# EAGLE design MotorSliderNoPower (EAGLE 9.6.2)
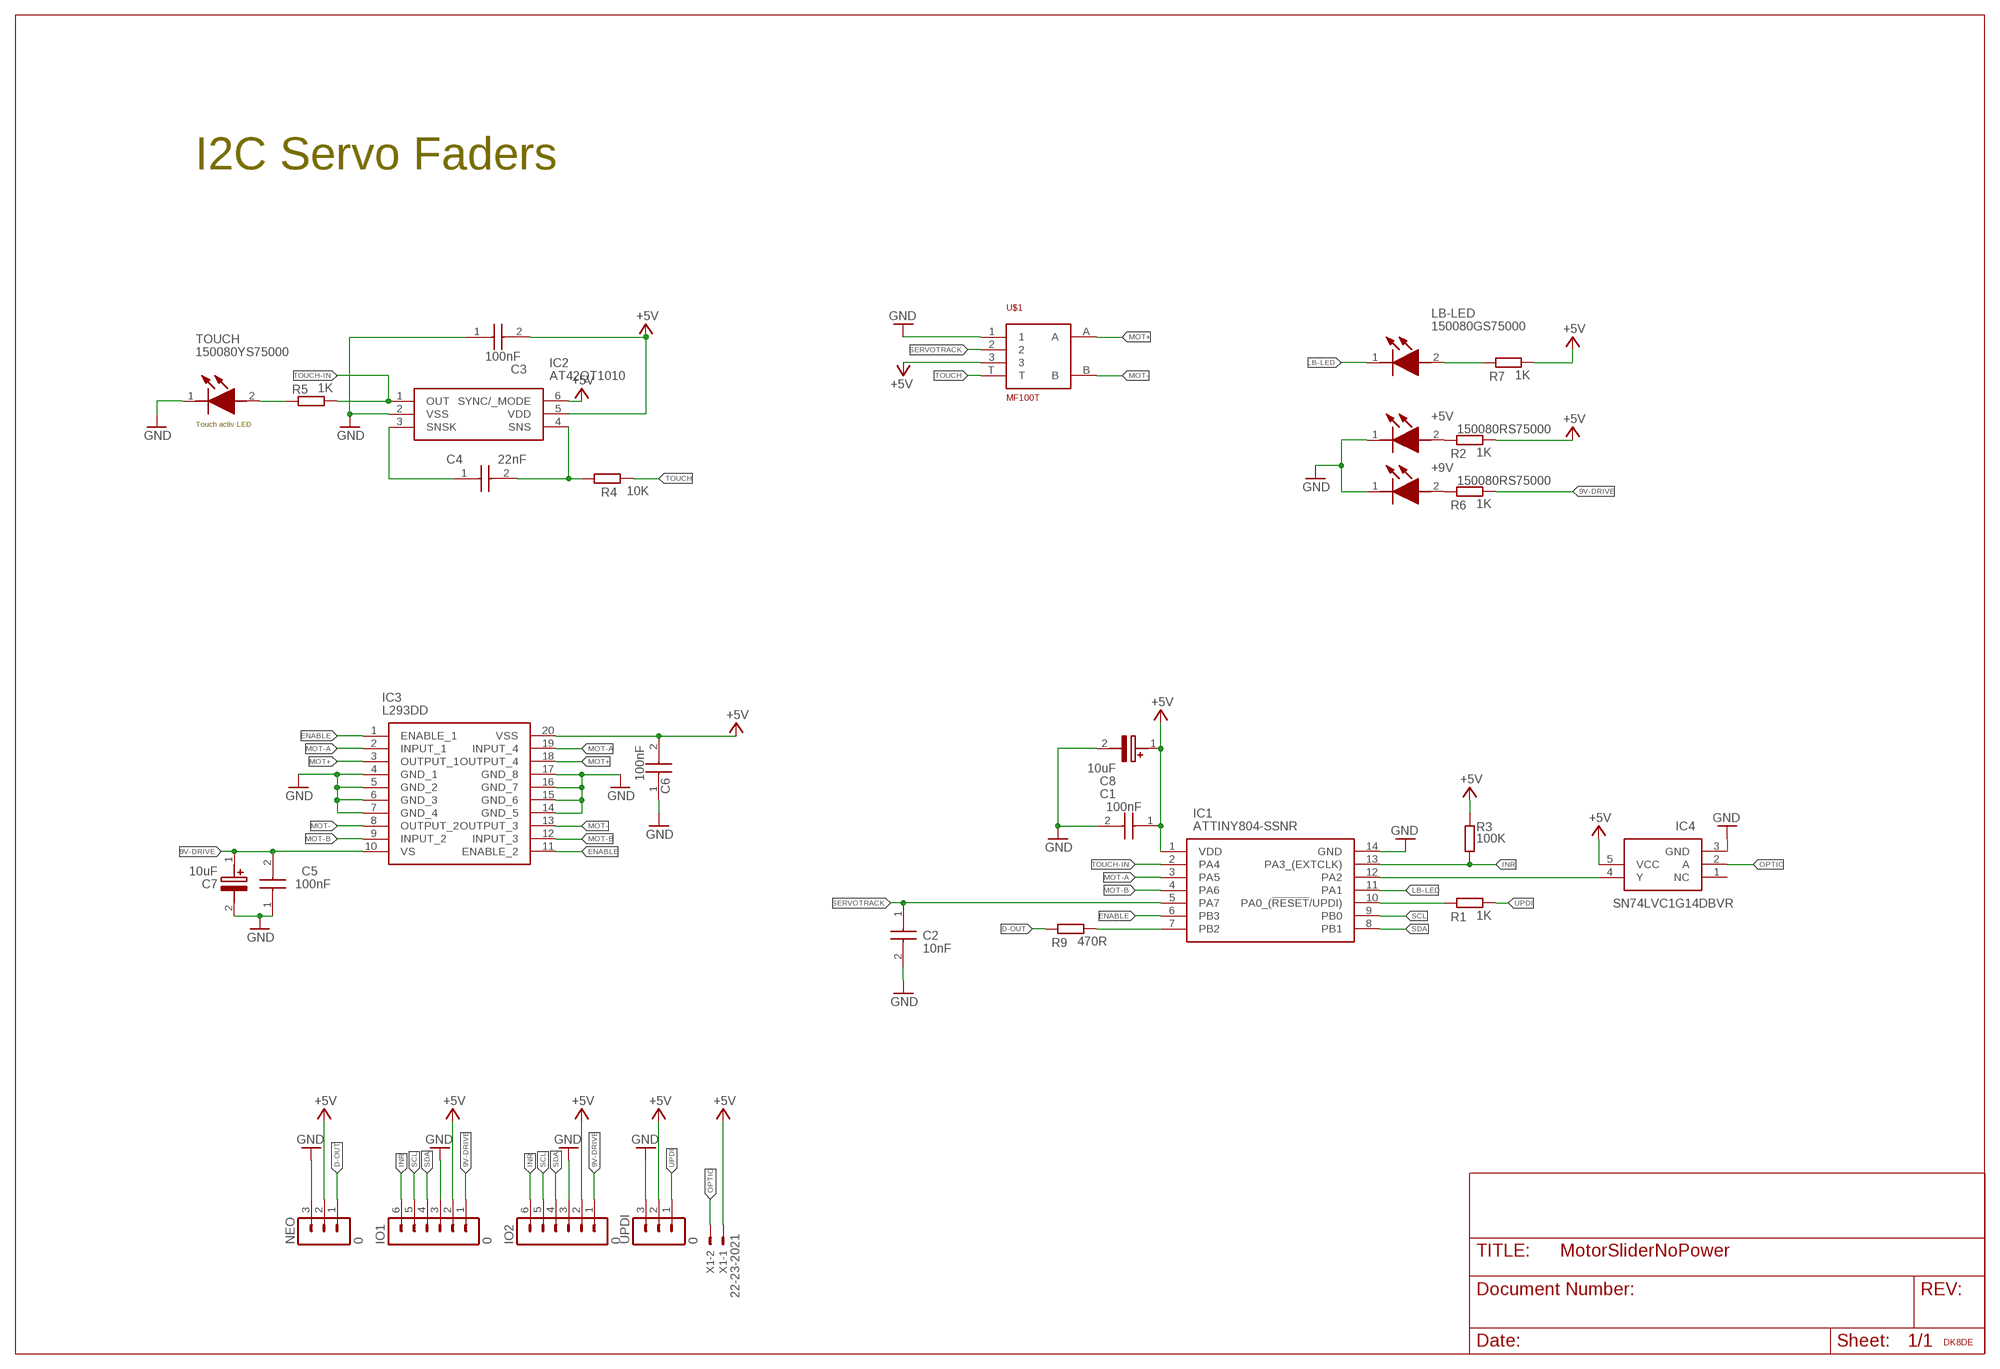
[diagram p0: schematic, sheet 1]

## Parts
+5V  150080RS75000  [LEDC2012X80N]
+9V  150080RS75000  [LEDC2012X80N]
C1  100nF  C0805C104K1RACTU  [C0805]
C2  10nF  C0805Y103K4RACTU  [C0805]
C3  100nF  C0805C104K1RACTU  [C0805]
C4  22nF  C0805C333K4RACTU  [C0805]
C5  100nF  C0805C104K1RACTU  [C0805]
C6  100nF  C0805C104K1RACTU  [C0805]
C7  10uF  EEE-HB1C100R  [EEE1AA220WR]
C8  10uF  EEE-HB1C100R  [EEE1AA220WR]
IC1  ATTINY804-SSNR  [SOIC127P600X175-14N]
IC2  AT42QT1010  AT42QT1010-TSHR  [SOT95P280X145-6N]
IC3  L293DD  [SOIC127P1032X265-20N]
IC4  SN74LVC1G14DBVR  [SOT95P280X145-5N]
IO1  0  MA06-1  [MA06-1]
IO2  0  MA06-1  [MA06-1]
LB-LED  150080GS75000  [LEDM2012X80N]
NEO  0  MA03-1  [MA03-1]
R1  1K  R-EU_R0805  [R0805]
R2  1K  R-EU_R0805  [R0805]
R3  100K  R-EU_R0805  [R0805]
R4  10K  R-EU_R0805  [R0805]
R5  1K  R-EU_R0805  [R0805]
R6  1K  R-EU_R0805  [R0805]
R7  1K  R-EU_R0805  [R0805]
R9  470R  R-EU_R0805  [R0805]
TOUCH  150080YS75000  [LEDC2012X80N]
U$1  MF100T  SM10001NKA0X-HA1  [SM10001NKA0X-HA1]
U$2  DK8DESS  [DK8DE_KLEIN]
UPDI  0  MA03-1  [MA03-1]
X1  22-23-2021  [22-23-2021]

## Nets
9V-DRIVE: C5.2 C7.1(+) IC3.10(VS) IO1.1 IO2.1 R6.2
+5V: C1.1 C3.2 C6.2 C8.1(+) IC1.1(VDD) IC2.5(VDD) IC2.6(SYNC/_MODE) IC3.20(VSS) IC4.5(VCC) IO1.2 IO2.2 NEO.2 R2.2 R3.1 R7.2 U$1.3 UPDI.2 X1.1
D-OUT: NEO.1 R9.1
ENABLE: IC1.6(PB3) IC3.1(ENABLE_1) IC3.11(ENABLE_2)
GND: +5V.1(K) +9V.1(K) C1.2 C2.2 C3.1 C5.1 C6.1 C7.2(-) C8.2(-) IC1.14(GND) IC2.2(VSS) IC3.4(GND_1) IC3.5(GND_2) IC3.6(GND_3) IC3.7(GND_4) IC3.14(GND_5) IC3.15(GND_6) IC3.16(GND_7) IC3.17(GND_8) IC4.3(GND) IO1.3 IO2.3 NEO.3 TOUCH.1(K) U$1.1 UPDI.3
INR: IC1.13(PA3_(EXTCLK)) IO1.6 IO2.6 R3.2
LB-LED: IC1.11(PA1) LB-LED.1(K)
MOT+: IC3.3(OUTPUT_1) IC3.18(OUTPUT_4) U$1.A
MOT-: IC3.8(OUTPUT_2) IC3.13(OUTPUT_3) U$1.B
MOT-A: IC1.3(PA5) IC3.2(INPUT_1) IC3.19(INPUT_4)
MOT-B: IC1.4(PA6) IC3.9(INPUT_2) IC3.12(INPUT_3)
N$1: IC1.10(PA0_(!RESET!/UPDI)) R1.1
N$2: +5V.2(A) R2.1
N$3: +9V.2(A) R6.1
N$4: IC1.12(PA2) IC4.4(Y)
N$5: LB-LED.2(A) R7.1
N$6: IC1.7(PB2) R9.2
N$7: C4.1 IC2.3(SNSK)
N$8: C4.2 IC2.4(SNS) R4.1
N$9: R5.1 TOUCH.2(A)
OPTIO: IC4.2(A) X1.2
SCL: IC1.9(PB0) IO1.5 IO2.5
SDA: IC1.8(PB1) IO1.4 IO2.4
SERVOTRACK: C2.1 IC1.5(PA7) U$1.2
TOUCH: R4.2 U$1.T
TOUCH-IN: IC1.2(PA4) IC2.1(OUT) R5.2
UPDI: R1.2 UPDI.1
Unconnected: IC4.1(NC)

## Notes on the sheet
- I2C Servo Faders
- Touch activ LED

## Library data of the parts
+5V +9V = SamacSys_Parts:150080RS75000: LED,Wurth Elektronik,150080RS75000 Wurth Elektronik 150080RS75000, WL-SMCW Series Red LED, 625 nm 2012 (0805) Clear, Rectangle Lens SMD package Source: Datasheet <https://componentsearchengine.com/Datasheets/2/150080RS75000.pdf>; DESCRIPTION: LED,Wurth Elektronik,150080RS75000 Wurth Elektronik 150080RS75000, WL-SMCW Series Red LED, 625 nm 2012 (0805) Clear, Rectangle Lens SMD package; HEIGHT: 0.8mm; MANUFACTURER_NAME: Wurth Elektronik; MANUFACTURER_PART_NUMBER: 150080RS75000; MOUSER_PART_NUMBER: 710-150080RS75000; MOUSER_PRICE-STOCK: https://www.mouser.co.uk/ProductDetail/Wurth-Elektronik/150080RS75000?qs=LlUlMxKIyB2jdCo7bnfgew%3D%3D
C1 C3 C5 C6 = SamacSys_Parts:C0805C104K1RACTU: SMD Comm X7R, Ceramic, 0.1 uF, 10%, 100 VDC, 250 VDC, 125C, -55C, X7R, SMD, MLCC, Temperature Stable, Class II, 2.5 % , 10 GOhms, 16 mg, 0805, 2mm, 1.25mm, 1mm, 0.75mm, 0.5mm, 2500, 78 Weeks, 80 Source: Datasheet <https://content.kemet.com/datasheets/KEM_C1002_X7R_SMD.pdf>; DESCRIPTION: SMD Comm X7R, Ceramic, 0.1 uF, 10%, 100 VDC, 250 VDC, 125C, -55C, X7R, SMD, MLCC, Temperature Stable, Class II, 2.5 % , 10 GOhms, 16 mg, 0805, 2mm, 1.25mm, 1mm, 0.75mm, 0.5mm, 2500, 78 Weeks, 80; HEIGHT: 1.1mm; MANUFACTURER_NAME: KEMET; MANUFACTURER_PART_NUMBER: C0805C104K1RACTU; MOUSER_PART_NUMBER: 80-C0805C104K1R; MOUSER_PRICE-STOCK: https://www.mouser.co.uk/ProductDetail/KEMET/C0805C104K1RACTU?qs=%252BnQd%252BVdkwTpk7hSy9esUqA%3D%3D
C2 = SamacSys_Parts:C0805Y103K4RACTU: SMD Comm X7R FF, Ceramic, 0.01 uF, 10%, 16 VDC, 40 VDC, 125C, -55C, X7R, SMD, MLCC, FF-CAP, Floating Electrode, 3.5 % , 100 GOhms, 13 mg, 0805, 2mm, 1.25mm, 0.78mm, 0.75mm, 0.5mm, 4000, 78 Weeks, 80 Source: Datasheet <https://content.kemet.com/datasheets/KEM_C1015_X7R_FF-CAP_SMD.pdf>; DESCRIPTION: SMD Comm X7R FF, Ceramic, 0.01 uF, 10%, 16 VDC, 40 VDC, 125C, -55C, X7R, SMD, MLCC, FF-CAP, Floating Electrode, 3.5 % , 100 GOhms, 13 mg, 0805, 2mm, 1.25mm, 0.78mm, 0.75mm, 0.5mm, 4000, 78 Weeks, 80; HEIGHT: 1.1mm; MANUFACTURER_NAME: KEMET; MANUFACTURER_PART_NUMBER: C0805Y103K4RACTU; MOUSER_PART_NUMBER: 80-C0805Y103K4R; MOUSER_PRICE-STOCK: https://www.mouser.co.uk/ProductDetail/KEMET/C0805Y103K4RACTU?qs=sbamQQFaV8yazvNwKcnfeQ%3D%3D
C4 = SamacSys_Parts:C0805C333K4RACTU: SMD Comm X7R, Ceramic, 0.033 uF, 10%, 16 VDC, 40 VDC, 125C, -55C, X7R, SMD, MLCC, Temperature Stable, Class II, 3.5 % , 30.303 GOhms, 11 mg, 0805, 2mm, 1.25mm, 0.78mm, 0.75mm, 0.5mm, 4000, 78 Weeks, 80 Source: Datasheet <https://content.kemet.com/datasheets/KEM_C1002_X7R_SMD.pdf>; DESCRIPTION: SMD Comm X7R, Ceramic, 0.033 uF, 10%, 16 VDC, 40 VDC, 125C, -55C, X7R, SMD, MLCC, Temperature Stable, Class II, 3.5 % , 30.303 GOhms, 11 mg, 0805, 2mm, 1.25mm, 0.78mm, 0.75mm, 0.5mm, 4000, 78 Weeks, 80; HEIGHT: 1.1mm; MANUFACTURER_NAME: KEMET; MANUFACTURER_PART_NUMBER: C0805C333K4RACTU; MOUSER_PART_NUMBER: 80-C0805C333K4R; MOUSER_PRICE-STOCK: https://www.mouser.co.uk/ProductDetail/KEMET/C0805C333K4RACTU?qs=2C4V03aRTluNFfWAly6Z3Q%3D%3D
C7 C8 = SamacSys_Parts:EEE-HB1C100R: SMD elec cap 10uF 16V Panasonic Aluminium Electrolytic Capacitor 10uF 16 V dc 4mm Surface Mount series HB SMD lifetime 2000h Source: Datasheet <http://industrial.panasonic.com/cdbs/www-data/pdf/RDE0000/ABA0000C1157.pdf>; DESCRIPTION: SMD elec cap 10uF 16V Panasonic Aluminium Electrolytic Capacitor 10uF 16 V dc 4mm Surface Mount series HB SMD lifetime 2000h; HEIGHT: 5.5mm; MANUFACTURER_NAME: Panasonic; MANUFACTURER_PART_NUMBER: EEE-HB1C100R; MOUSER_PART_NUMBER: 667-EEE-HB1C100R; MOUSER_PRICE-STOCK: https://www.mouser.co.uk/ProductDetail/Panasonic/EEE-HB1C100R?qs=Ywefl8B65e6oXncmMfFctg%3D%3D
IC1 = SamacSys_Parts:ATTINY804-SSNR: 8-bit Microcontrollers - MCU 20MHz, 8KB, SOIC14, Ind 105C, Green, T&R Source: Datasheet <https://componentsearchengine.com/Datasheets/1/ATTINY804-SSNR.pdf>; DESCRIPTION: 8-bit Microcontrollers - MCU 20MHz, 8KB, SOIC14, Ind 105C, Green, T&R; HEIGHT: 1.75mm; MANUFACTURER_NAME: Microchip; MANUFACTURER_PART_NUMBER: ATTINY804-SSNR; MOUSER_PART_NUMBER: 556-ATTINY804-SSNR; MOUSER_PRICE-STOCK: https://www.mouser.co.uk/ProductDetail/Microchip-Technology/ATTINY804-SSNR?qs=T3oQrply3y%252BBKoVZpNVlTw%3D%3D
IC2 = SamacSys_Parts:AT42QT1010-TSHR: AT42QT1010-TSHR, Spread-Spectrum Charge-Transfer Touch Screen Controller, 14 bit, 6-Pin SOT-23 Source: Datasheet <http://www.atmel.com/images/atmel-9541-at42-qtouch-bsw-at42qt1010_datasheet.pdf>; DESCRIPTION: AT42QT1010-TSHR, Spread-Spectrum Charge-Transfer Touch Screen Controller, 14 bit, 6-Pin SOT-23; HEIGHT: 1.45mm; MANUFACTURER_NAME: Microchip; MANUFACTURER_PART_NUMBER: AT42QT1010-TSHR; MOUSER_PART_NUMBER: 556-AT42QT1010-TSHR; MOUSER_PRICE-STOCK: https://www.mouser.co.uk/ProductDetail/Microchip-Technology/AT42QT1010-TSHR?qs=xbJoyvfFV%2F%252BFK88JVR2efg%3D%3D
IC3 = SamacSys_Parts:L293DD: L293DD, Motor Driver, 4.5 36 V, 20-Pin SOIC Source: Datasheet <https://www.st.com/resource/en/datasheet/l293d.pdf>; DESCRIPTION: L293DD, Motor Driver, 4.5 36 V, 20-Pin SOIC; HEIGHT: 2.65mm; MANUFACTURER_NAME: STMicroelectronics; MANUFACTURER_PART_NUMBER: L293DD; MOUSER_PART_NUMBER: 511-L293DD; MOUSER_PRICE-STOCK: https://www.mouser.co.uk/ProductDetail/STMicroelectronics/L293DD?qs=m4gxtLzGBzoksItTiSkcgg%3D%3D
IC4 = SamacSys_Parts:SN74LVC1G14DBVR: TEXAS INSTRUMENTS - SN74LVC1G14DBVR - IC, SCHMITT TRIGGER INVERTER, SMD Source: Datasheet <https://datasheet.datasheetarchive.com/originals/distributors/Datasheets-DGA13/1136296.pdf>; DESCRIPTION: TEXAS INSTRUMENTS - SN74LVC1G14DBVR - IC, SCHMITT TRIGGER INVERTER, SMD; HEIGHT: 1.45mm; MANUFACTURER_NAME: Texas Instruments; MANUFACTURER_PART_NUMBER: SN74LVC1G14DBVR; MOUSER_PART_NUMBER: 595-SN74LVC1G14DBVR; MOUSER_PRICE-STOCK: https://www.mouser.co.uk/ProductDetail/Texas-Instruments/SN74LVC1G14DBVR?qs=dT9u2OTAaVWRIgCrQFnxuQ%3D%3D
IO1 IO2 = con-lstb_IBM:MA06-1: PIN HEADER; OC_FARNELL: unknown; OC_NEWARK: unknown
LB-LED = SamacSys_Parts:150080GS75000: 150080GS75000, Wurth Elektronik WL-SMCW 520 nm Green LED, 2012 (0805) Clear SMD package Source: Datasheet <https://katalog.we-online.com/led/datasheet/150080GS75000.pdf>; DESCRIPTION: 150080GS75000, Wurth Elektronik WL-SMCW 520 nm Green LED, 2012 (0805) Clear SMD package; HEIGHT: 0.8mm; MANUFACTURER_NAME: Wurth Elektronik; MANUFACTURER_PART_NUMBER: 150080GS75000; MOUSER_PART_NUMBER: 710-150080GS75000; MOUSER_PRICE-STOCK: https://www.mouser.co.uk/ProductDetail/Wurth-Elektronik/150080GS75000?qs=2kOmHSv6VfQRoTEZVk1mGA%3D%3D
NEO UPDI = con-lstb:MA03-1: PIN HEADER; OC_FARNELL: unknown; OC_NEWARK: unknown
R1-R7 R9 = rcl:R-EU_: RESISTOR, European symbol; SPICEPREFIX: R
TOUCH = SamacSys_Parts:150080YS75000: LED,Wurth Elektronik,150080YS75000 Source: Datasheet <https://katalog.we-online.de/led/datasheet/150080YS75000.pdf>; DESCRIPTION: LED,Wurth Elektronik,150080YS75000; HEIGHT: 0.8mm; MANUFACTURER_NAME: Wurth Elektronik; MANUFACTURER_PART_NUMBER: 150080YS75000; MOUSER_PART_NUMBER: 710-150080YS75000; MOUSER_PRICE-STOCK: https://www.mouser.co.uk/ProductDetail/Wurth-Elektronik/150080YS75000?qs=LlUlMxKIyB3k0fZGrDMI2w%3D%3D
U$1 = Slider:SM10001NKA0X-HA1: Behringer X-Touch Motor-Fader MF100T
U$2 = LOGOS:DK8DE
X1 = con-molex:22-23-2021: .100" (2.54mm) Center Header - 2 Pin; MF: MOLEX; MPN: 22-23-2021; OC_FARNELL: 1462926; OC_NEWARK: 25C3832

## Board
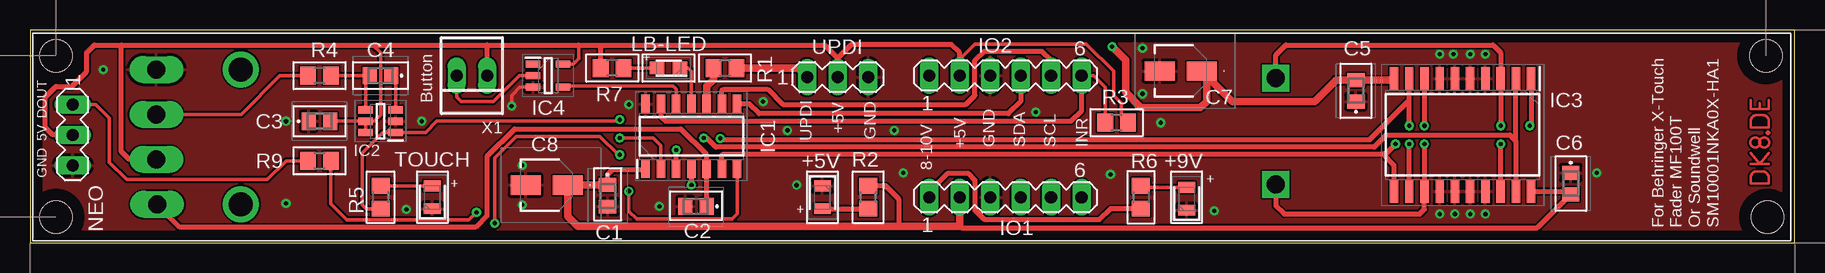
[diagram p1: board, top side]
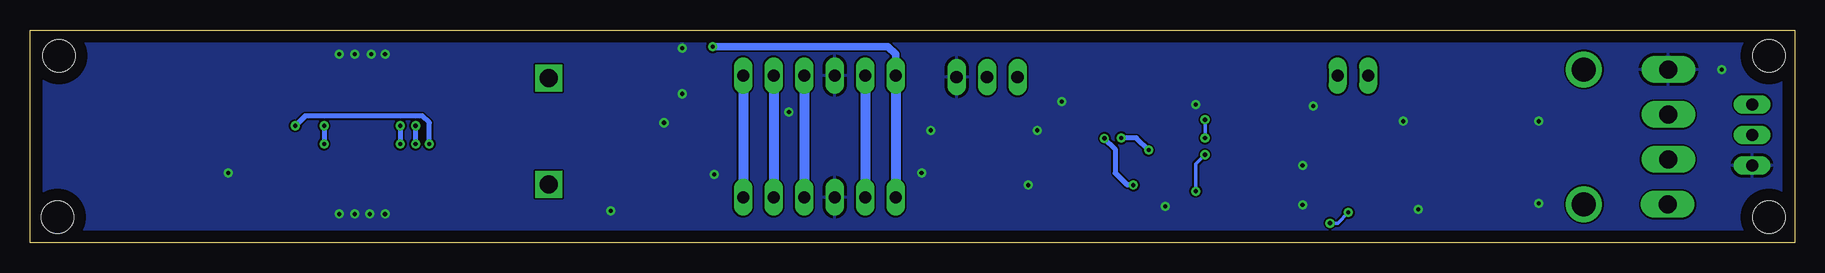
[diagram p2: board, bottom side, seen from below]

Size 147.07 x 17.78 mm. Coordinates in mm from the lower left corner, seen from the top.
Outline: 0,0 147.07,0 147.07,17.78 0,17.78 0,0
Copper layers (1*16): Top 0.035mm / dielectric 0.15mm / Bottom 0.035mm
Design rules "Aisler": minimum track width 6mil, minimum drill 0.35mm, track to track 6mil, track to pad 6mil, pad to pad 6mil, via to via 6mil, smd to smd 6mil, copper to edge 40mil, drill to drill 6mil, minimum pad ring 10mil, minimum via ring 8mil, stop-mask expansion 4mil, vias tented up to drill 0mil, thermal gap 10mil
Holes 2.69 mm at 144.65,15.62 144.78,2.16 2.16,15.62 2.16,2.16

### Footprints (pad centres in the part's own frame; a part is rotated, then mirrored left to right if it is on the bottom)
LEDC2012X80N = smd 0.9 x 1.4: 1 -0.95,0; 2 0.95,0
C0805 = smd 1.15 x 1.45: 1 -0.9,0; 2 0.9,0
EEE1AA220WR = smd 2.5 x 1.6: 1 -1.75,0; 2 1.75,0
SOIC127P600X175-14N = smd 1.525 x 0.7: 1 -2.712,3.81; 2 -2.712,2.54; 3 -2.712,1.27; 4 -2.712,0; 5 -2.712,-1.27; 6 -2.712,-2.54; 7 -2.712,-3.81; 8 2.712,-3.81; 9 2.712,-2.54; 10 2.712,-1.27; 11 2.712,0; 12 2.712,1.27; 13 2.712,2.54; 14 2.712,3.81
SOT95P280X145-6N = smd 1.2 x 0.6: 1 -1.25,0.95; 2 -1.25,0; 3 -1.25,-0.95; 4 1.25,-0.95; 5 1.25,0; 6 1.25,0.95
SOIC127P1032X265-20N = smd 1.925 x 0.7: 1 -4.712,5.715; 2 -4.712,4.445; 3 -4.712,3.175; 4 -4.712,1.905; 5 -4.712,0.635; 6 -4.712,-0.635; 7 -4.712,-1.905; 8 -4.712,-3.175; 9 -4.712,-4.445; 10 -4.712,-5.715; 11 4.712,-5.715; 12 4.712,-4.445; 13 4.712,-3.175; 14 4.712,-1.905; 15 4.712,-0.635; 16 4.712,0.635; 17 4.712,1.905; 18 4.712,3.175; 19 4.712,4.445; 20 4.712,5.715
SOT95P280X145-5N = smd 1.2 x 0.6: 1 -1.25,0.95; 2 -1.25,0; 3 -1.25,-0.95; 4 1.25,-0.95; 5 1.25,0.95
MA06-1 = drill 1.016 long: 1 -6.35,0; 2 -3.81,0; 3 -1.27,0; 4 1.27,0; 5 3.81,0; 6 6.35,0
LEDM2012X80N = smd 1.2 x 1.05: 1 -0.95,0; 2 0.95,0
MA03-1 = drill 1.016 long: 1 -2.54,0; 2 0,0; 3 2.54,0
R0805 = smd 1.3 x 1.5: 1 -0.95,0; 2 0.95,0
SM10001NKA0X-HA1 = drill 1.5 long: 1 0,0; 2 0.05,-11.25; 3 0,-7.5; T 0,-3.75 | drill 1.5 square: A 93.291,-0.703; B 93.291,-9.61 | drill 2: P$7 7.032,-11.251; P$8 7.032,0
22-23-2021 = drill 1 long: 1 -1.27,0; 2 1.27,0

### Placement (x,y rotation side)
+5V  66.04,3.81 270 top
+9V  96.39,3.68 90 top
C1  48.13,3.94 270 top
C2  55.5,3.05 180 top
C3  24.13,10.16 0 top
C4  29.21,13.97 180 top
C5  110.49,12.7 90 top
C6  128.4,4.95 270 top
C7  95.89,14.35 180 top
C8  43.05,4.83 180 top
IC1  55.12,8.89 90 top
IC2  29.21,10.16 180 top
IC3  119.38,9.02 270 top
IC4  43.18,13.97 0 top
IO1  81.28,3.81 0 top
IO2  81.28,13.97 0 top
LB-LED  53.21,14.61 180 top
NEO  3.56,9.02 270 top
R1  57.91,14.61 0 top
R2  69.85,3.81 90 top
R3  90.55,10.03 180 top
R4  24.13,13.97 180 top
R5  29.21,3.81 270 top
R6  92.58,3.81 270 top
R7  48.51,14.61 180 top
R9  24.13,6.86 0 top
TOUCH  33.53,3.81 90 top
U$1  10.54,14.48 0 top
U$2  144.15,7.75 90 top
UPDI  67.31,13.84 0 top
X1  36.83,13.97 180 top

### Tracks (layer width: path | path; a pad name or v marks a point on that pad's centre or on a via)
9V-DRIVE  (via drill 0.35)
  Top 0.406: R6.2 90.04,2.86 89.11,1.93 79.55,1.93 78.77,2.71 78.77,5.24 78.21,5.79 76.45,5.79 74.93,4.27 IO1.1
  Top 0.61: v90.17,16.39 91.31,15.24 91.31,12.57 92.58,11.3 97.54,11.3 98.04,11.81 98.04,13.94 C7.1 100.17,11.81 107.06,11.81 108.85,13.6 C5.2 113.54,13.6 IC3.10
  Bottom 0.61: IO2.1 74.93,15.75 75.57,16.39 v90.17,16.39
  Bottom 0.813: IO2.1 IO1.1
+5V
  Top 0.305: IC2.5 28.7,10.16 29.21,10.67 29.21,15.88 28.57,16.51 | C3.2 IC2.5 | IC2.5 IC2.6 | 47.75,16.51 45.72,16.51 45.72,15.37 45.27,14.92 IC4.5 | 38.1,16.51 28.57,16.51 | 47.75,16.51 66.22,16.51 | 47.56,16.32 47.75,16.51 | 28.57,16.51 7.62,16.51 | IO2.2 77.47,15.34 78.74,16.61 88.04,16.61 90.3,14.35 90.3,12.32 90.93,11.68 90.93,10.6 R3.1
  Top 0.406: IO2.2 77.47,15.88 76.78,16.56 68.45,16.56 67.31,15.42 | C1.1 48.13,5.73 48.51,6.11 51.24,6.11 IC1.1 | IC3.20 128.15,4.3 C6.2 125.61,1.27 77.6,1.27 77.47,1.4 | 72.39,1.4 72.39,3.68 71.31,4.76 R2.2 | U$1.3 8.26,6.98 7.62,7.62 7.62,16.51 | 7.62,16.51 38.1,16.51 | 38.1,16.51 45.72,16.51 66.22,16.51 67.31,15.42 | UPDI.2 67.31,15.42 | R7.2 47.56,16.32 | NEO.2 1.91,9.02 1.27,9.65 1.27,12.17 2.16,13.06 3.48,13.06 4.72,14.3 4.72,15.88 5.36,16.51 7.62,16.51 | X1.1 38.1,16.51
  Top 0.61: C1.1 44.81,4.84 C8.1 44.8,2.24 45.64,1.4 72.39,1.4 77.47,1.4 IO1.2
  Bottom 0.813: IO2.2 IO1.2
D-OUT
  Top 0.305: NEO.1 5.46,11.56 6.6,10.41 6.6,6.73 8.05,5.29 19.76,5.29 21.34,6.86 R9.1
ENABLE  (via drill 0.35)
  Top 0.406: IC1.6 57.66,7.32 57.76,7.42 112.72,7.42 | IC3.11 113.67,6.48 112.72,7.42 | IC3.1 125.09,9.91 v124.97,9.78 | v113.79,8.26 112.96,7.42 112.72,7.42
  Bottom 0.406: v113.79,8.26 113.79,10.03 114.36,10.6 124.14,10.6 v124.97,9.78
GND  (via drill 0.35)
  Top 0.305: IC4.3 40.83,13.02 40.13,12.32 v40.13,11.43
  other vias: 49.91,11.56 41.02,6.48 41.02,3.17 31.37,2.79 21.34,10.16 92.71,16.26 92.71,12.45 98.68,2.67 120.02,2.41 120.02,15.75 130.56,5.84 61.09,11.81 63.88,4.83 72.01,9.4 72.77,5.84 90.04,5.71 94.23,10.03 63.12,9.4 118.62,15.75 118.75,2.41 117.47,2.41 121.28,2.41 117.47,15.75 121.28,15.75 52.45,3.05 32.64,10.16 21.34,3.3 6.1,14.48 83.82,10.92
  pour Bottom: 0,17.78 147.07,17.78 147.07,0 0,0
  pour Top: 0,17.78 147.07,17.78 147.07,0 0,0
INR
  Top 0.305: IO2.6 88.65,13.97 89.6,13.02 R3.2
  Top 0.406: IC1.13 52.58,10.54 52.96,10.16 86.74,10.16 87.63,11.05 IO2.6
  Bottom 0.813: IO2.6 IO1.6
LB-LED
  Top 0.305: LB-LED.1 54.86,14.61 55.12,14.35 IC1.11
MOT+  (via drill 0.35)
  Top 0.406: v122.56,9.78 IC3.3 122.56,15.88 121.92,16.51 104.66,16.51 103.83,15.68 U$1.A | IC3.18 v122.56,8.26
  Bottom 0.406: v122.56,9.78 v122.56,8.26
MOT-  (via drill 0.35)
  Top 0.406: U$1.B 103.83,3.09 104.51,2.41 115.82,2.41 116.2,2.79 IC3.13 v116.2,8.26 | IC3.8 v116.2,9.78
  Bottom 0.406: v116.2,9.78 v116.2,8.26
MOT-A  (via drill 0.35)
  Top 0.406: IC1.3 v53.85,7.75 | v56.13,8.76 56.39,8.76 57.15,8 112.01,8 113.03,9.02 123.32,9.02 123.83,8.51 | 123.83,8.51 IC3.19 | 123.83,8.51 IC3.2
  Bottom 0.406: v56.13,8.76 54.86,8.76 v53.85,7.75
MOT-B  (via drill 0.35)
  Top 0.406: IC1.4 v55.12,4.83 | v57.53,8.73 57.66,8.61 111.61,8.61 114.94,11.94 | IC3.12 v114.94,8.26 | v114.94,9.78 114.94,11.94 | 114.94,11.94 IC3.9
  Bottom 0.406: v55.12,4.83 55.63,4.83 56.64,5.84 56.64,7.85 v57.53,8.73 | v114.94,8.26 v114.94,9.78
N$1
  Top 0.61: R1.1 56.96,13.65 56.39,13.08 IC1.10
N$2
  Top 0.406: +5V.2 R2.1
N$3
  Top 0.305: +9V.2 92.71,4.63 R6.1
N$4
  Top 0.305: IC1.12 53.85,12.83 53.59,13.08 45.72,13.08 44.89,13.08 44.49,13.08 IC4.4
N$5
  Top 0.305: LB-LED.2 R7.1
N$6  (via drill 0.35)
  Top 0.305: R9.2 25.08,3.24 26.42,1.91 36.58,1.91 v37.21,2.54 | v38.73,1.65 38.73,7.11 40.51,8.89 47.5,8.89 49.02,7.37 v49.15,7.37 | IC1.7 58.93,2.41 58.52,2.01 50.55,2.01 49.91,2.64 v49.91,4.32
  Bottom 0.305: v37.21,2.54 38.1,1.65 v38.73,1.65 | v49.91,4.32 49.91,6.6 v49.15,7.37
N$7
  Top 0.305: C4.1 30.46,13.62 IC2.3
N$8
  Top 0.305: R4.1 C4.2 27.96,13.62 IC2.4
N$9
  Top 0.305: R5.1 TOUCH.2
OPTIO
  Top 0.305: X1.2 35.56,12.19 35.94,11.81 38.61,11.81 40.77,13.97 IC4.2
SCL
  Top 0.406: IC1.9 57.66,12.7 57.78,12.83 61.47,12.83 62.74,11.56 77.98,11.56 78.74,12.32 78.74,15.24 79.5,16 84.33,16 85.09,15.24 IO2.5
  Bottom 0.813: IO2.5 IO1.5
SDA
  Top 0.406: IO2.4 82.55,11.81 81.53,10.79 60.75,10.79 59.94,11.6 IC1.8
  Bottom 0.813: IO2.4 IO1.4
SERVOTRACK
  Top 0.406: U$1.2 12.5,1.32 37.13,1.32 38.1,2.29 38.1,7.24 40.39,9.53 54.23,9.53 56.39,7.37 56.39,6.35 | IC1.5 56.39,6.35 | C2.1 56.4,6.34 56.39,6.35
TOUCH
  Top 0.305: U$1.T 17.59,10.73 20.83,13.97 R4.2
TOUCH-IN  (via drill 0.35)
  Top 0.305: R5.2 28,2.86 27.69,3.17 27.69,7.49 29.4,9.21 IC2.1 32.96,9.21 33.91,10.16 49.02,10.16 v49.15,10.29 | v49.15,8.76 51.94,8.76 52.58,8.13 IC1.2
  Bottom 0.305: v49.15,10.29 v49.15,8.76
UPDI
  Top 0.61: R1.2 64.01,14.61 UPDI.1

### Text on the board
tPlace: + | Button | DOUT | 5V | UPDI | +5V | GND | +5V | GND | SDA | SCL | INR | 8-10V | GND | + | + | + | For Behringer X-Touch / Fader MF100T / Or Soundwell / SM10001NKA0X-HA1